# EAGLE design opl2msx_v1_1 (EAGLE 6.6.0)
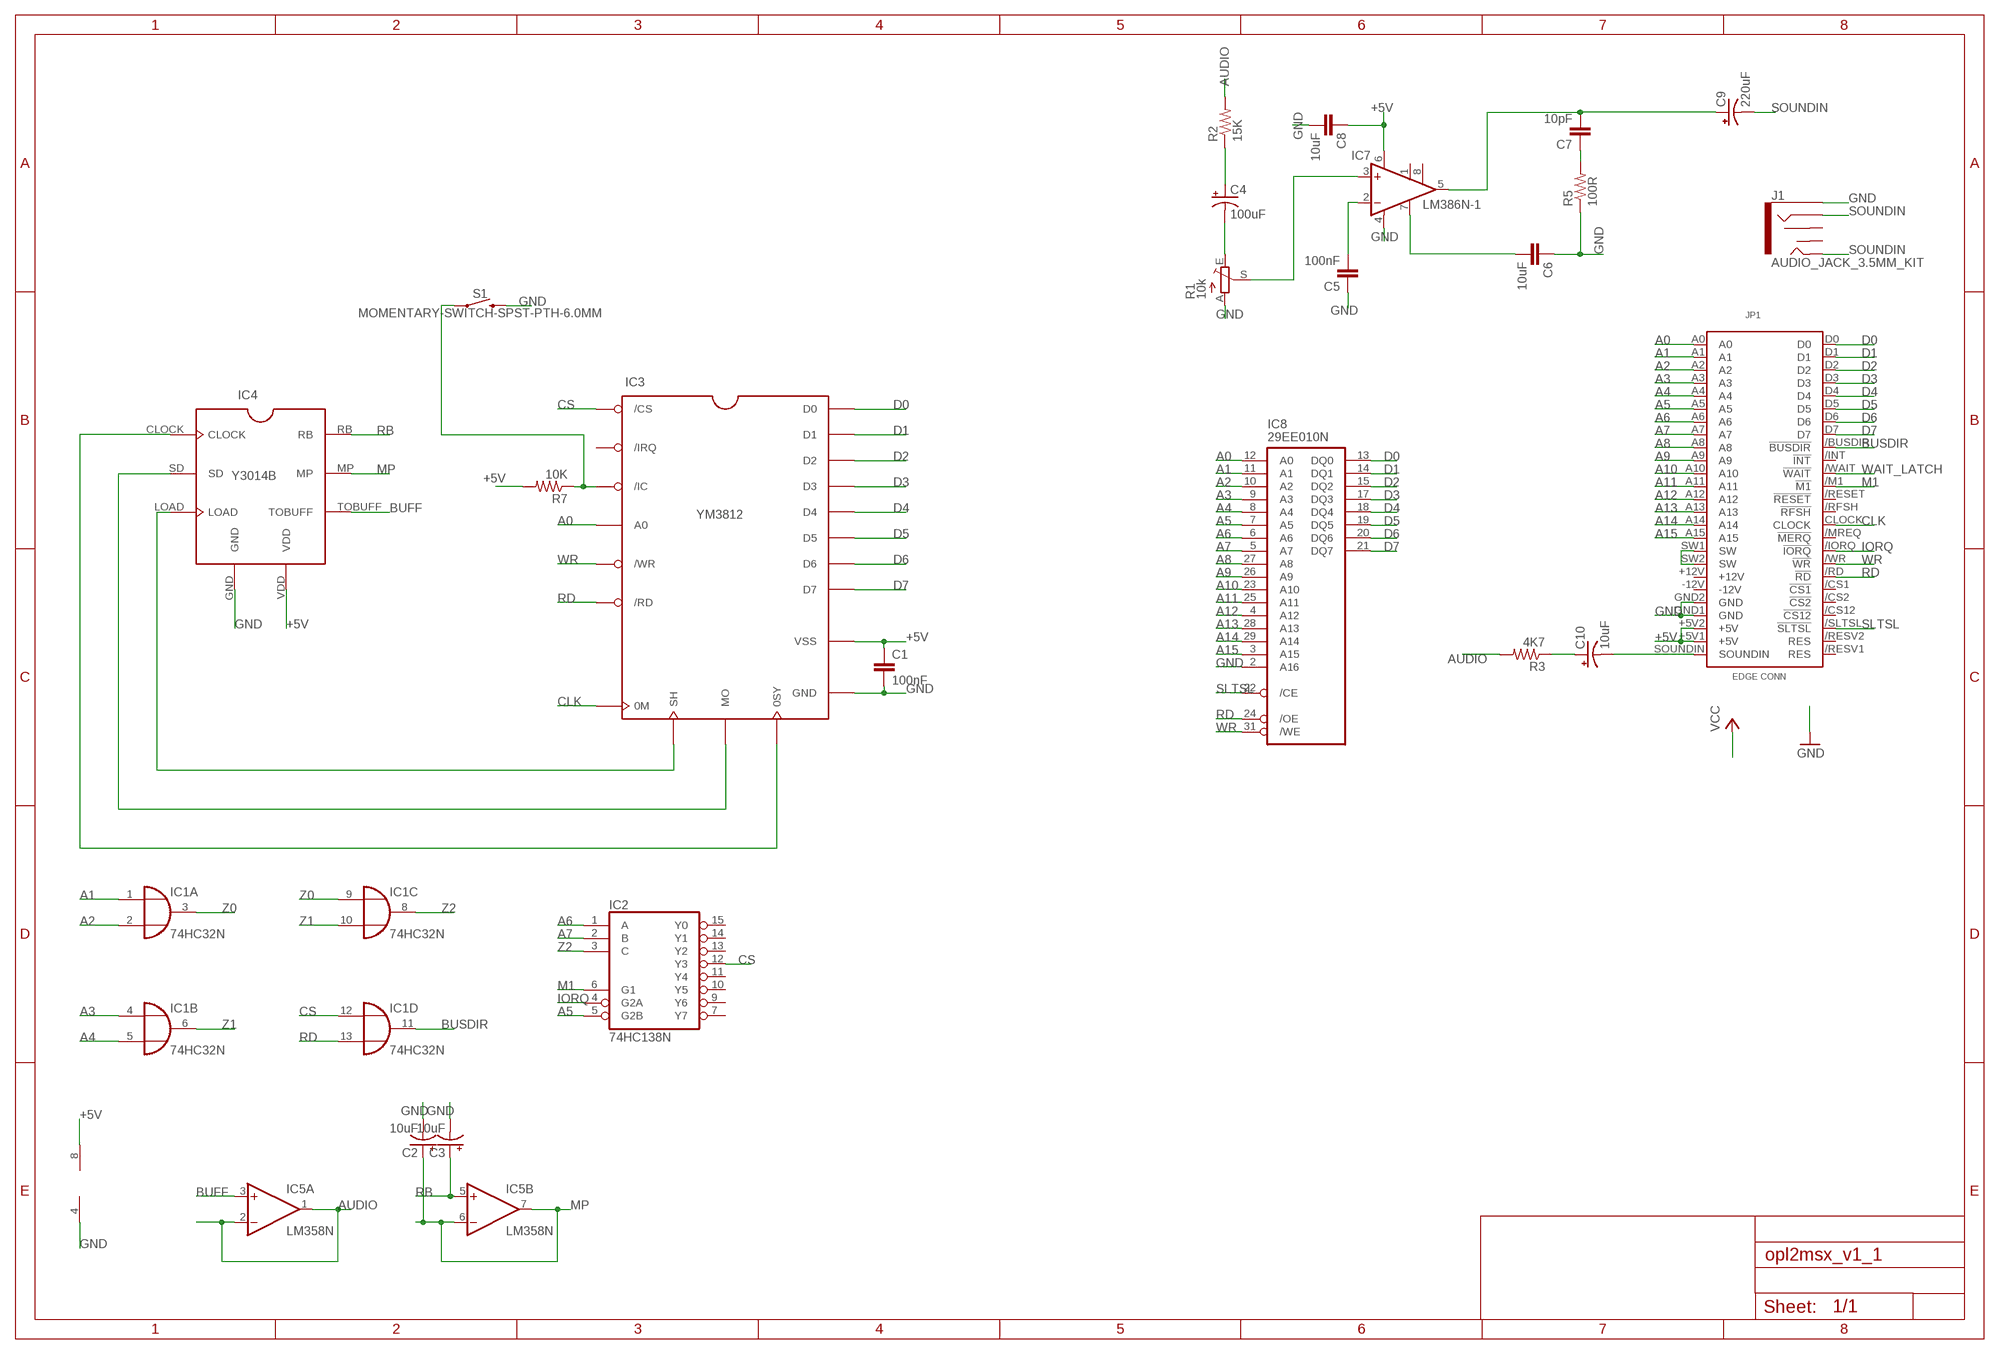
[diagram p0: schematic, sheet 1]

## Parts
C1  100nF  C-EU050-024X044  [C050-024X044]
C2  10uF  CPOL-USE2.5-6  [E2,5-6]
C3  10uF  CPOL-USE2.5-6  [E2,5-6]
C4  100uF  CPOL-USE2.5-6  [E2,5-6]
C5  100nF  C-EU050-024X044  [C050-024X044]
C6  10uF  C-EU050-024X044  [C050-024X044]
C7  10pF  C-EU050-024X044  [C050-024X044]
C8  10uF  C-EU050-024X044  [C050-024X044]
C9  220uF  CPOL-USE2.5-6  [E2,5-6]
C10  10uF  CPOL-USE2.5-6  [E2,5-6]
IC1  74HC32N  [DIL14]
IC2  74HC138N  [DIL16]
IC3  YM3812  YM3812-DIP24  [YM3812]
IC4  Y3014B  YM3014B-DIP8  [YM3014B]
IC5  LM358N  [DIL08]
IC7  LM386N-1  [DIL08]
IC8  29EE010N  29XE010N  [DIL32-6]
J1  AUDIO_JACK_3.5MM_KIT  [AUDIO-JACK-KIT]
JP1  MSXCART  [PATOLA-MSX-SEEED]
R1  10k  TRIM_EU-CA6V  [CA6V]
R2  15K  R-US_0207/10  [0207/10]
R3  4K7  R-US_0207/10  [0207/10]
R5  100R  R-US_0207/10  [0207/10]
R7  10K  R-US_0207/10  [0207/10]
S1  MOMENTARY-SWITCH-SPST-PTH-6.0MM  [TACTILE_SWITCH_PTH_6.0MM]

## Nets
+5V: C1.1 C8.1 IC3.VSS IC4.VDD IC5.8(P:V+) IC7.6(VS) JP1.+5V1(+5V) JP1.+5V2(+5V) R7.2 ; supply symbol labelled VCC
A0: IC3.A0 IC8.12(A0) JP1.A0
A1: IC1.1(A:I0) IC8.11(A1) JP1.A1
A2: IC1.2(A:I1) IC8.10(A2) JP1.A2
A3: IC1.4(B:I0) IC8.9(A3) JP1.A3
A4: IC1.5(B:I1) IC8.8(A4) JP1.A4
A5: IC2.5(G2B) IC8.7(A5) JP1.A5
A6: IC2.1(A) IC8.6(A6) JP1.A6
A7: IC2.2(B) IC8.5(A7) JP1.A7
A8: IC8.27(A8) JP1.A8
A9: IC8.26(A9) JP1.A9
A10: IC8.23(A10) JP1.A10
A11: IC8.25(A11) JP1.A11
A12: IC8.4(A12) JP1.A12
A13: IC8.28(A13) JP1.A13
A14: IC8.29(A14) JP1.A14
A15: IC8.3(A15) JP1.A15
AUDIO: IC5.1(A:OUT) IC5.2(A:-IN) R2.2 R3.2
BUFF: IC4.TOBUFF IC5.3(A:+IN)
BUSDIR: IC1.11(D:O) JP1./BUSDIR(!BUSDIR)
CLK: IC3.0M JP1.CLOCK
CS: IC1.12(D:I0) IC2.12(Y3) IC3./CS
D0: IC3.D0 IC8.13(DQ0) JP1.D0
D1: IC3.D1 IC8.14(DQ1) JP1.D1
D2: IC3.D2 IC8.15(DQ2) JP1.D2
D3: IC3.D3 IC8.17(DQ3) JP1.D3
D4: IC3.D4 IC8.18(DQ4) JP1.D4
D5: IC3.D5 IC8.19(DQ5) JP1.D5
D6: IC3.D6 IC8.20(DQ6) JP1.D6
D7: IC3.D7 IC8.21(DQ7) JP1.D7
GND: C1.2 C2.- C3.- C5.1 C6.1 C8.2 IC3.GND IC4.GND IC5.4(P:V-) IC7.4(GND) IC8.2(A16) J1.SLEEVE JP1.GND1(GND) JP1.GND2(GND) R1.A R5.1 S1.3
IORQ: IC2.4(G2A) JP1./IORQ(!IORQ)
M1: IC2.6(G1) JP1./M1(!M1)
MP: C2.+ IC4.MP IC5.6(B:-IN) IC5.7(B:OUT)
N$1: C4.+ R2.1
N$2: C6.2 IC7.7(BYPASS)
N$3: C4.- R1.E
N$4: IC7.3(+IN) R1.S
N$5: C5.2 IC7.2(-IN)
N$6: C10.- JP1.SOUNDIN
N$7: C10.+ R3.1
N$9: C7.2 C9.+ IC7.5(OUT)
N$12: C7.1 R5.2
N$13: IC3.SH IC4.LOAD
N$14: IC3.MO IC4.SD
N$15: IC3.0SY IC4.CLOCK
N$16: IC3./IC R7.1 S1.1
N$30: JP1.SW1(SW) JP1.SW2(SW)
RB: C3.+ IC4.RB IC5.5(B:+IN)
RD: IC1.13(D:I1) IC3./RD IC8.24(/OE) JP1./RD(!RD)
SLTSL: IC8.22(/CE) JP1./SLTSL(!SLTSL)
SOUNDIN: C9.- J1.RING J1.TIP
WAIT_LATCH: JP1./WAIT(!WAIT)
WR: IC3./WR IC8.31(/WE) JP1./WR(!WR)
Z0: IC1.3(A:O) IC1.9(C:I0)
Z1: IC1.6(B:O) IC1.10(C:I1)
Z2: IC1.8(C:O) IC2.3(C)
Unconnected: IC2.7(Y7) IC2.9(Y6) IC2.10(Y5) IC2.11(Y4) IC2.13(Y2) IC2.14(Y1) IC2.15(Y0) IC3./IRQ IC7.1(GAIN) IC7.8(GAIN) IC8.1(NC) IC8.30(NC) J1.RSH J1.TSH JP1.+12V JP1.-12V JP1./CS1(!CS1) JP1./CS2(!CS2) JP1./CS12(!CS12) JP1./INT(!INT) JP1./MREQ(!MERQ) JP1./RESET(!RESET) JP1./RESV1(RES) JP1./RESV2(RES) JP1./RFSH(!RFSH)

## Power pins joined to a net without a drawn wire
+5V: IC1.14(P:VCC) IC2.16(VCC) IC8.32(VCC)
GND: IC1.7(P:GND) IC2.8(GND) IC8.16(GND)

## Library data of the parts
C1 C5-C8 = rcl:C-EU: CAPACITOR, European symbol
C2-C4 C9 C10 = rcl:CPOL-US: POLARIZED CAPACITOR, American symbol
IC1 = 74xx-eu:74*32: Quad 2-input OR gate
IC2 = 74xx-eu:74*138: 3-line to 8-line DECODER/DEMULTIPLEXER
IC3 = YMSynth:YM3812: YM3812
IC4 = YMSynth:YM3014B: YM3014B
IC5 = linear:LM358: OP AMP also LM158; LM258; LM2904 Source: http://cache.national.com/ds/LM/LM158.pdf
IC7 = linear:LM386?-*: Low Voltage Audio Power Amplifier Source: http://cache.national.com/ds/LM/LM386.pdf
IC8 = memories:29XE010
J1 = SparkFun-Connectors:AUDIO_JACK_3.5MM: Audio Jack 3.5mm variants of PTH and SMT stereo audio jack with bypass switches. SparkFun Products: SparkFun SparkPunk Sound Kit <[https://www.sparkfun.com/products/11177]> - PTH MP3 Trigger <https://www.sparkfun.com/products/13720> -3.5mm SMD SparkFun PicoBoard <https://www.sparkfun.com/products/11888>- 2.5mm SMD; PROD_ID: CONN-08774; SF_ID: PRT-08032
JP1 = msx-con-seeed:MSXCART
R1 = pot:TRIM_EU-: POTENTIOMETER
R2 R3 R5 R7 = resistor:R-US_: RESISTOR, American symbol
S1 = SparkFun-Switches:MOMENTARY-SWITCH-SPST: Momentary Switch (Pushbutton) - SPST Normally-open (NO) SPST momentary switches (buttons, pushbuttons). Variants PTH-12MM - 12mm square, through-hole Momentary Pushbutton Switch - 12mm Square <https://www.sparkfun.com/products/9190> (COM-09190) PTH-6.0MM, PTH-6.0MM-KIT - 6.0mm square, through-hole Mini Pushbutton Switch <https://www.sparkfun.com/products/97> (COM-00097) KIT package intended for soldering kit's - only one side of pads' copper is exposed. PTH-RIGHT-ANGLE-KIT - Right-angle, through-hole Right Angle Tactile Button <https://www.sparkfun.com/products/10791> - Used on SparkFun BigTime Watch Kit <https://www.sparkfun.com/products/11734> SMD-12MM - 12mm square, surface-mount Tactile Button - SMD (12mm) <https://www.sparkfun.com/products/12993> (COM-12993) Used on SparkFun PicoBoard <https://www.sparkfun.com/products/11888> SMD-4.5MM - 4.5mm Square Trackball Switch Used on SparkFun Blackberry Trackballer Breakout <https://www.sparkfun.com/products/13169> SMD-4.6MMX2.8MM - 4.60mm x 2.80mm, surface mount Used on SparkFun SAMD21 Mini Breakout <https://www.sparkfun.com/products/13664> SMD-5.2MM, SMD-5.2-REDUNDANT - 5.2mm square, surface-mount Mini Pushbutton Switch - SMD <https://www.sparkfun.com/products/8720> (COM-08720) Used on Arduino Pro Mini <https://www.sparkfun.com/products/11114> REDUNDANT package connects both switch circuits together SMD-6.0X3.5MM - 6.0 x 3.5mm, surface mount Momentary Reset Switch SMD <https://www.sparkfun.com/products/8229> (COM-08229) SMD-6.2MM-TALL - 6.2mm square, surface mount Tactile Button - SMD (6mm) <https://www.sparkfun.com/products/12992> Used on SparkFun Digital Sandbox <https://www.sparkfun.com/products/12651> SMD-RIGHT-ANGLE - Right-angle, surface mount Used on SparkFun Block for Intel® Edison - Arduino <https://www.sparkfun.com/products/13036>; PROD_ID: SWCH-08441; SF_SKU: COM-00097

## Board
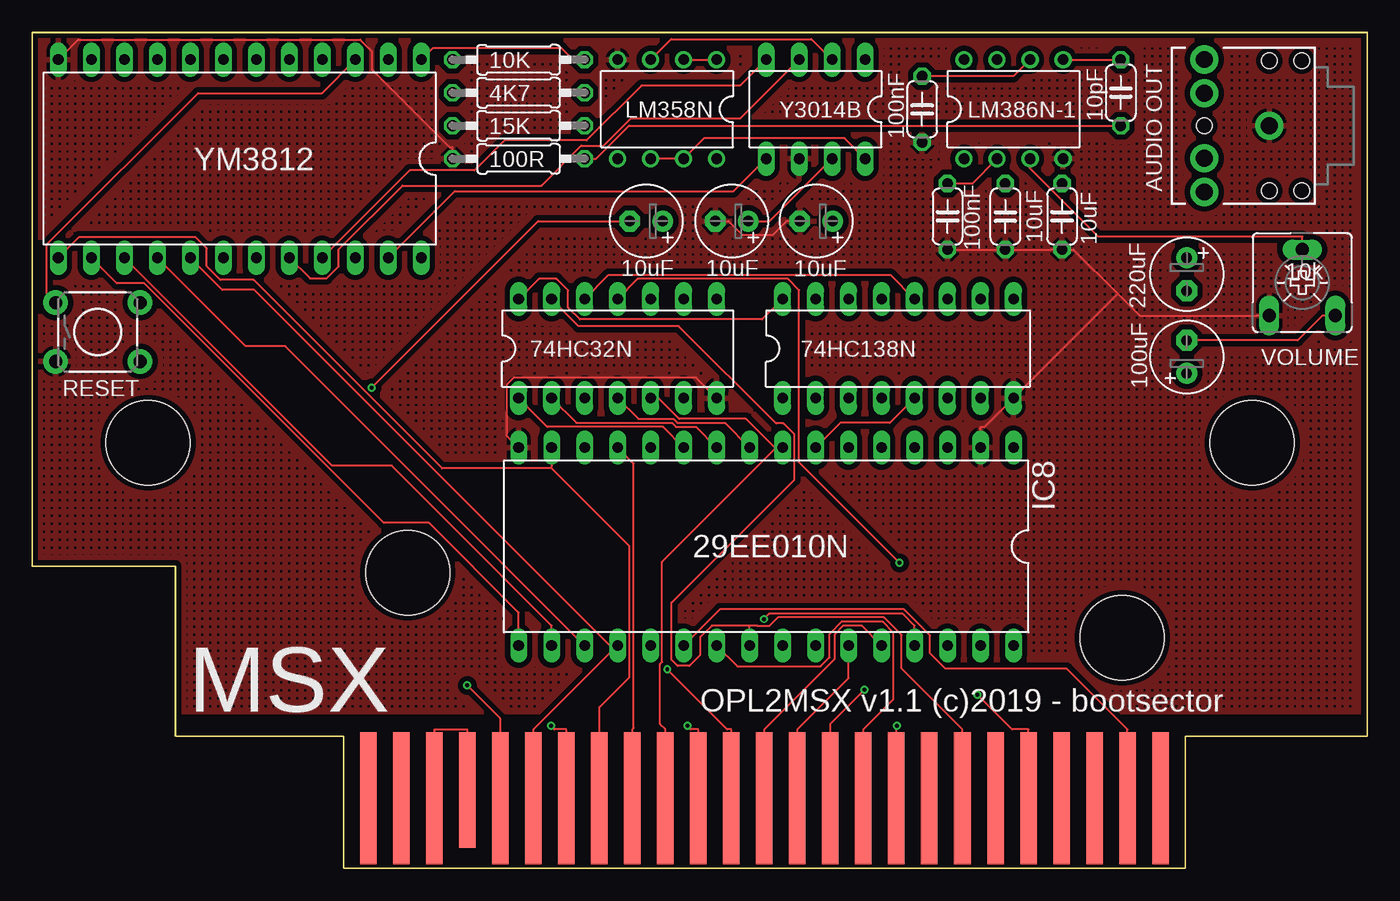
[diagram p1: board, top side]
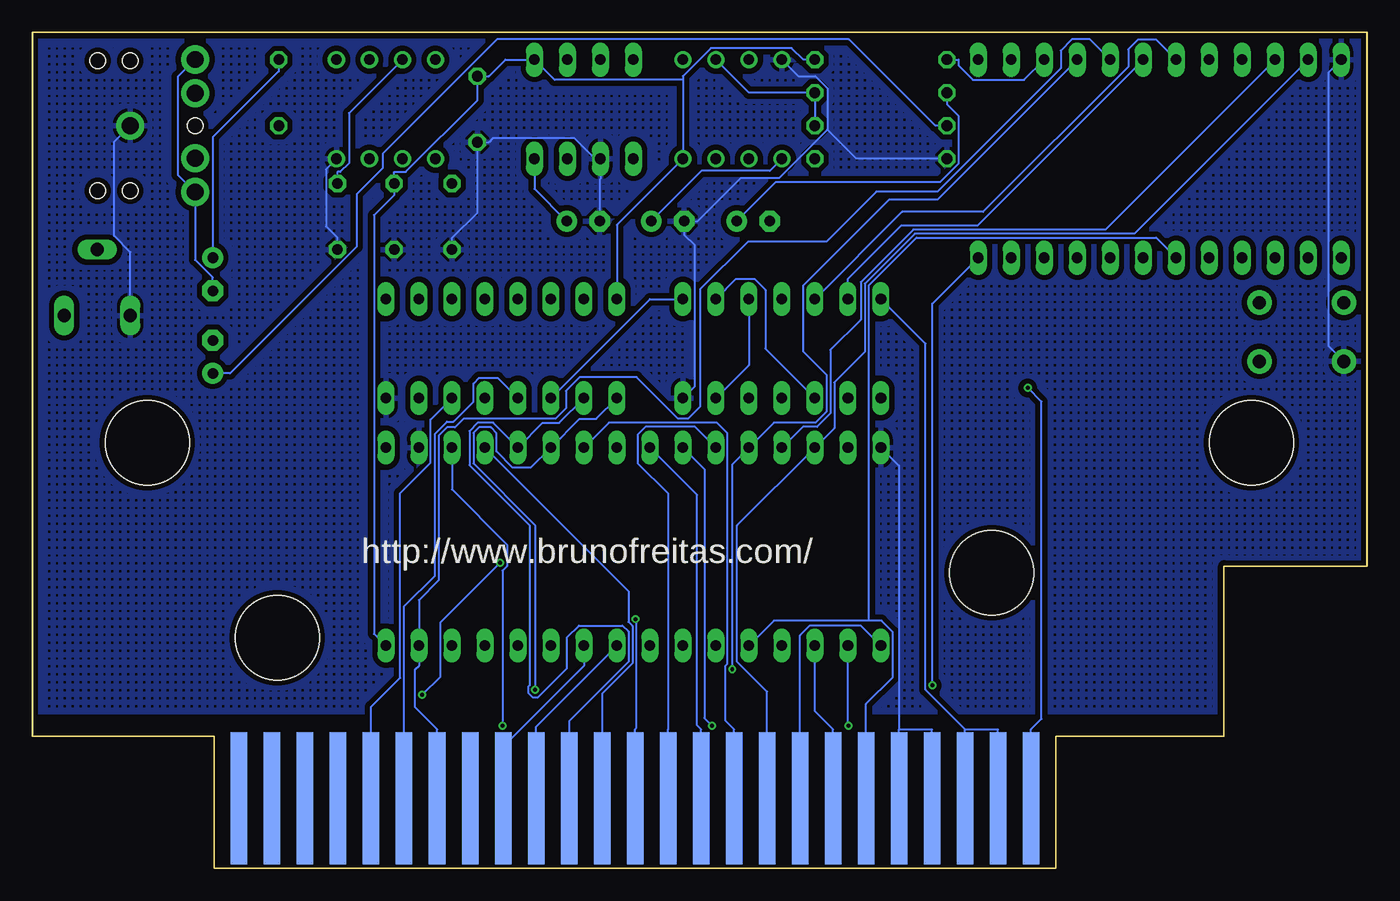
[diagram p2: board, bottom side, seen from below]

Size 102.72 x 64.33 mm. Coordinates in mm from the lower left corner, seen from the top.
Outline: 0,64.31 102.72,64.31 102.72,10.16 88.72,10.16 88.72,0 23.95,0 23.95,10.16 11,10.16 11,23.27 0,23.27 0,64.31
Copper layers (1*16): Top 0.035mm / dielectric 1.5mm / Bottom 0.035mm
Design rules "SeeedStudio_2layer_DRU_no_angle_20140221": minimum track width 6mil, minimum drill 12mil, track to track 6mil, track to pad 6mil, pad to pad 6mil, via to via 6mil, smd to smd 0mil, copper to edge 10mil, drill to drill 10mil, minimum pad ring 10mil, minimum via ring 6mil, stop-mask expansion 2mil, vias tented up to drill 100mil, thermal gap 10mil

### Footprints (pad centres in the part's own frame; a part is rotated, then mirrored left to right if it is on the bottom)
C050-024X044 = drill 0.813 octagon: 1 -2.54,0; 2 2.54,0
E2,5-6 = drill 0.813 pad 1.6: + -1.27,0 | drill 0.813 pad 1.6 octagon: - 1.27,0
DIL14 = drill 0.813 long: 1 -7.62,-3.81; 2 -5.08,-3.81; 3 -2.54,-3.81; 4 0,-3.81; 5 2.54,-3.81; 6 5.08,-3.81; 7 7.62,-3.81; 8 7.62,3.81; 9 5.08,3.81; 10 2.54,3.81; 11 0,3.81; 12 -2.54,3.81; 13 -5.08,3.81; 14 -7.62,3.81
DIL16 = drill 0.813 long: 1 -8.89,-3.81; 2 -6.35,-3.81; 3 -3.81,-3.81; 4 -1.27,-3.81; 5 1.27,-3.81; 6 3.81,-3.81; 7 6.35,-3.81; 8 8.89,-3.81; 9 8.89,3.81; 10 6.35,3.81; 11 3.81,3.81; 12 1.27,3.81; 13 -1.27,3.81; 14 -3.81,3.81; 15 -6.35,3.81; 16 -8.89,3.81
YM3812 = drill 0.813 long: 0M -13.97,7.62; 0SY -11.43,7.62; /CS 1.27,-7.62; /IC -8.89,-7.62; /IRQ -11.43,-7.62; /RD -1.27,-7.62; /WR -3.81,-7.62; A0 -6.35,-7.62; D0 8.89,-7.62; D1 11.43,-7.62; D2 13.97,7.62; D3 11.43,7.62; D4 8.89,7.62; D5 6.35,7.62; D6 3.81,7.62; D7 1.27,7.62; GND 13.97,-7.62; MO -6.35,7.62; NC8 3.81,-7.62; NC9 6.35,-7.62; NC19 -1.27,7.62; NC22 -8.89,7.62; SH -3.81,7.62; VSS -13.97,-7.62
YM3014B = drill 0.813 long: CLOCK 3.81,3.81; GND 1.27,3.81; LOAD 1.27,-3.81; MP -3.81,3.81; RB -1.27,3.81; SD 3.81,-3.81; TOBUFF -1.27,-3.81; VDD -3.81,-3.81
DIL08 = drill 0.813 pad 1.27: 1 -3.81,-3.81; 2 -1.27,-3.81; 3 1.27,-3.81; 4 3.81,-3.81; 5 3.81,3.81; 6 1.27,3.81; 7 -1.27,3.81; 8 -3.81,3.81
DIL32-6 = drill 0.813 long: 1 -19.05,-7.62; 2 -16.51,-7.62; 3 -13.97,-7.62; 4 -11.43,-7.62; 5 -8.89,-7.62; 6 -6.35,-7.62; 7 -3.81,-7.62; 8 -1.27,-7.62; 9 1.27,-7.62; 10 3.81,-7.62; 11 6.35,-7.62; 12 8.89,-7.62; 13 11.43,-7.62; 14 13.97,-7.62; 15 16.51,-7.62; 16 19.05,-7.62; 17 19.05,7.62; 18 16.51,7.62; 19 13.97,7.62; 20 11.43,7.62; 21 8.89,7.62; 22 6.35,7.62; 23 3.81,7.62; 24 1.27,7.62; 25 -1.27,7.62; 26 -3.81,7.62; 27 -6.35,7.62; 28 -8.89,7.62; 29 -11.43,7.62; 30 -13.97,7.62; 31 -16.51,7.62; 32 -19.05,7.62
AUDIO-JACK-KIT = drill 1.3 pad 2.184: RING 5,5.1; RSH 5,2.5; SLEEVE 0,0; TIP 5,-5.1; TSH 5,-2.5 | hole 1.2: 0,5; -2.5,5; -2.5,-5; 0,-5; 5,0
PATOLA-MSX-SEEED = smd 1.27 x 10.16 bottom: +5V1 -24.13,-35.242; +5V2 -21.59,-35.242; /CS1 34.29,-35.242; /CS12 31.75,-35.242; /IORQ 21.59,-35.242; /M1 24.13,-35.242; /RESET 16.51,-35.242; /RESV2 29.21,-35.242; /WAIT 26.67,-35.242; /WR 19.05,-35.242; A1 1.27,-35.242; A3 -1.27,-35.242; A5 -3.81,-35.242; A7 8.89,-35.242; A9 13.97,-35.242; A11 11.43,-35.242; A12 6.35,-35.242; A14 3.81,-35.242; D1 -6.35,-35.242; D3 -8.89,-35.242; D5 -11.43,-35.242; D7 -13.97,-35.242; GND1 -19.05,-35.242; GND2 -16.51,-35.242; SOUNDIN -26.67,-35.242 | smd 1.27 x 10.16: +12V -24.13,-35.242; -12V -26.67,-35.242; /BUSDIR 24.13,-35.242; /CS2 34.29,-35.242; /INT 26.67,-35.242; /MREQ 21.59,-35.242; /RD 19.05,-35.242; /RESV1 16.51,-35.242; /RFSH 29.21,-35.242; /SLTSL 31.75,-35.242; A0 1.27,-35.242; A2 -1.27,-35.242; A4 -3.81,-35.242; A6 8.89,-35.242; A8 6.35,-35.242; A10 11.43,-35.242; A13 3.81,-35.242; A15 13.97,-35.242; CLOCK -16.51,-35.242; D0 -6.35,-35.242; D2 -8.89,-35.242; D4 -11.43,-35.242; D6 -13.97,-35.242; SW2 -21.59,-35.242 | smd 1.27 x 8.89: SW1 -19.05,-34.608 | hole 6.5: 41.35,-7.89; -43.64,-7.89; -23.64,-17.89; 31.35,-22.89
CA6V = drill 1.016 long: A -2.54,-2.54; E 2.54,-2.54; S 0,2.54
0207/10 = drill 0.813 octagon: 1 -5.08,0; 2 5.08,0
TACTILE_SWITCH_PTH_6.0MM = drill 1.016 pad 1.88: 1 -3.251,2.261; 2 3.251,2.261; 3 -3.251,-2.261; 4 3.251,-2.261

### Placement (x,y rotation side)
C1  68.48,58.42 270 top
C2  60.33,49.81 180 top
C3  53.83,49.81 180 top
C4  88.85,39.37 90 top
C5  70.44,50.16 90 top
C6  79.25,50.16 90 top
C7  83.77,59.69 90 top
C8  74.88,50.16 270 top
C9  88.85,45.72 270 top
C10  47.25,49.81 180 top
IC1  45.04,40.01 0 top
IC2  66.63,40.01 0 top
IC3  15.95,54.61 180 top
IC4  60.28,58.42 180 top
IC5  48.85,58.42 180 top
IC7  75.52,58.42 0 top
IC8  56.47,24.77 180 top
J1  95.2,57.15 180 top
JP1  52.53,40.64 0 top
R1  97.74,45.09 0 top
R2  37.42,57.15 0 top
R3  37.42,59.69 0 top
R5  37.42,54.61 0 top
R7  37.42,62.23 0 top
S1  5.03,41.27 0 top

### Tracks (layer width: path | path; a pad name or v marks a point on that pad's centre or on a via)
+5V
  Top 0.152: IC2.16 56.17,42.25 42.14,42.25 41.23,43.16 41.23,44.47 40.33,45.38 38.98,45.38 IC1.14 | IC7.6 75.52,60.96 C1.1 | R7.2 41.61,62.23 40.71,63.12 30.82,63.12 IC3.VSS
  Bottom 0.152: 30.94,10.71 33.99,13.75 33.99,40.39 IC1.14 | 52.66,60.67 IC5.8 57.74,49.53 IC2.16 | 52.66,60.67 52.66,60.97 50.5,63.13 44.29,63.13 43.39,62.23 R7.2 | 52.66,60.67 62.53,60.67 IC4.VDD 66.32,62.23 67.59,60.96 C1.1 68.48,59.11 73.99,53.59 74.88,53.59 C8.1 74.88,51.82 76.43,50.27 76.43,18.06 IC8.32 | JP1.+5V2 30.94,10.71 | 30.94,10.71 28.4,10.71 JP1.+5V1
A0  (via drill 0.3 pad 0.61)
  Top 0.152: JP1.A0 53.8,10.71 53.47,10.71 v48.86,15.32
  Bottom 0.152: IC3.A0 33.07,51.47 36.79,51.47 43.41,44.85 43.41,39.79 41.61,37.99 41.61,35.15 42.45,34.3 45.66,34.3 IC8.12 48.86,31.1 v48.86,15.32
A1
  Top 0.152: IC8.11 48.52,33.98 39.63,33.98 IC1.1
  Bottom 0.152: JP1.A1 53.8,10.71 53.8,28.85 56.14,31.19 56.14,33.39 55.52,34 51.73,34 IC8.11
A2  (via drill 0.3 pad 0.61)
  Top 0.152: JP1.A2 51.26,10.71 50.69,10.71 v50.42,10.98 | IC1.2 41.86,34.29 49.22,34.29 49.52,33.98 51.06,33.98 IC8.10
  Bottom 0.152: IC8.10 51.01,30.73 51.01,11.57 v50.42,10.98
A3
  Top 0.152: IC1.4 46.64,34.59 49.34,34.59 49.65,34.29 53.29,34.29 IC8.9
  Bottom 0.152: JP1.A3 51.26,10.71 51.56,11.01 51.56,28.75 IC8.9
A4
  Top 0.152: 57.18,32.32 57.23,32.36 57.71,32.36 IC8.8 | 57.18,32.32 48.47,23.6 48.47,15.89 48.32,15.74 48.32,11.11 48.72,10.71 JP1.A4 | 57.18,32.32 54.91,34.59 49.77,34.59 48.17,36.2 IC1.5
A5
  Top 0.152: IC2.5 65.99,34.29 62.18,34.29 IC8.7
  Bottom 0.152: JP1.A5 48.72,10.71 49.39,11.38 49.39,15.59 49.23,15.76 49.23,33.48 50.05,34.3 58.36,34.3 IC8.7
A6  (via drill 0.3 pad 0.61)
  Top 0.152: JP1.A6 61.42,11.12 v64.04,13.74
  Bottom 0.152: v64.04,13.74 64.04,26.42 68.79,31.17 68.79,33.51 68.36,33.94 67.44,33.94 67.01,33.5 67.01,32.09 65.75,30.84 64.37,30.84 IC8.6 60.61,34.59 59.34,34.59 IC2.1
A7
  Bottom 0.152: JP1.A7 61.42,11.33 56.85,15.9 56.85,18.23 57.31,18.7 60.67,18.7 61.58,17.78 61.58,15.41 63.81,13.19 64.25,13.19 64.58,13.52 64.58,13.96 64.44,14.1 64.44,26.39 69.1,31.05 69.1,33.65 68.45,34.3 67.27,34.3 IC8.5 63.46,34.28 62.19,34.28 IC2.2
A8
  Top 0.152: JP1.A8 58.88,10.71 62.82,14.64 IC8.27
A9
  Bottom 0.152: IC8.26 60.28,15.6 66.5,9.37 JP1.A9
A10
  Top 0.152: IC8.23 54.25,15.55 60.67,15.55 61.35,16.23 61.35,18.04 62.32,19.01 65.41,19.01 66.25,18.17 66.25,12.99 63.96,10.71 JP1.A10
A11
  Bottom 0.152: JP1.A11 63.96,10.92 IC8.25
A12
  Bottom 0.152: IC8.4 56.85,21.34 56.85,18.97 56.54,18.67 56.54,15.77 58.88,13.44 JP1.A12
A13
  Top 0.152: IC8.28 63.8,18.7 62.44,18.7 61.76,18.02 61.76,16.13 56.34,10.71 JP1.A13
A14  (via drill 0.3 pad 0.61)
  Top 0.152: v56.31,19.19 56.74,19.62 66.97,19.62 67.9,18.7 IC8.29
  Bottom 0.152: v56.31,19.19 56.24,19.12 56.24,10.81 56.34,10.71 JP1.A14
A15  (via drill 0.3 pad 0.61)
  Top 0.152: JP1.A15 66.5,10.71 66.55,10.76 v66.55,10.98
  Bottom 0.152: IC8.3 70.44,29.16 66.2,24.92 66.2,23.27 66.55,22.91 v66.55,10.98
AUDIO
  Top 0.152: IC5.2 IC5.1
  Bottom 0.152: IC5.2 47.58,59.69 R3.2 R2.2
BUFF
  Top 0.152: IC5.3 49.16,63.82 59.96,63.82 IC4.TOBUFF
BUSDIR  (via drill 0.3 pad 0.61)
  Top 0.152: v66.74,23.52 59.01,31.25 59.01,44.5 58.14,45.36 46.59,45.36 IC1.11 | JP1./BUSDIR 76.66,10.71 75.39,10.71 v72.73,13.37
  Bottom 0.152: v72.73,13.37 71.33,14.77 71.33,18.93 v66.74,23.52
CLK  (via drill 0.3 pad 0.61)
  Top 0.152: JP1.CLOCK 36.02,11.53 v33.45,14.1
  Bottom 0.152: v33.45,14.1 33.45,43.46 IC3.0M
CS
  Top 0.152: IC1.12 44.36,45.67 66.04,45.67 IC2.12
  Bottom 0.152: IC3./CS 16.24,63.78 17.63,63.78 18.39,63.03 18.39,61.68 29.55,50.52 35.8,50.52 IC1.12
D0
  Top 0.152: JP1.D0 46.18,10.71 46.28,10.8 46.28,31.14 IC8.13
  Bottom 0.152: IC3.D0 20.14,49.15 34.93,49.15 38.96,45.12 38.96,42.24 41.3,39.9 41.3,35.02 42.34,33.98 43.44,33.98 | 43.44,33.98 | 43.44,33.98 IC8.13
D1
  Bottom 0.152: JP1.D1 46.18,13.6 48.48,15.9 48.48,26.4 IC8.14 41,33.88 41,37.41 38.66,39.76 38.66,45 34.81,48.84 17.91,48.84 IC3.D1
D2
  Top 0.152: JP1.D2 43.64,12.41 45.94,14.71 45.94,24.8 39.96,30.79 | 39.96,30.79 39.96,30.91 IC8.15 | 39.96,30.79 31.51,30.79 17.01,45.29 14.46,45.29 13.41,46.34 13.41,47.71 12.56,48.56 3.56,48.56 IC3.D2
D3
  Top 0.152: IC8.17 37.42,19.7 30.53,26.58 27.04,26.58 8.6,45.02 6.49,45.02 IC3.D3
  Bottom 0.152: JP1.D3 43.64,17.94 42.88,18.71 38.98,18.71 IC8.17
D4  (via drill 0.3 pad 0.61)
  Top 0.152: JP1.D4 41.1,10.71 40.17,10.71 v39.9,10.98 | IC3.D4 23.05,31 27.65,31 39.96,18.7 IC8.18
  Bottom 0.152: v39.9,10.98 39.96,11.04 IC8.18
D5
  Top 0.152: IC8.19 19.45,40.19 16.41,40.19 IC3.D5
  Bottom 0.152: JP1.D5 41.1,10.71 42.5,12.1 IC8.19
D6
  Top 0.152: 44.72,16.87 17.07,44.52 14.61,44.52 IC3.D6 | IC8.20 44.76,16.87 44.72,16.87 | 44.72,16.87 | 44.72,16.87 38.56,10.71 JP1.D6
D7
  Bottom 0.152: 38.35,19.06 38.35,44.87 34.68,48.54 16.23,48.54 IC3.D7 | JP1.D7 38.56,12.66 36.5,14.73 36.5,18.18 37.38,19.06 38.35,19.06 | 38.35,19.06 45.66,19.06 IC8.21
GND
  Top 0.152: C2.- 58.03,49.81 57,48.78 54.61,48.78 53.58,49.81 C3.- | 83.54,44.22 84.71,43.06 | 84.71,43.06 | 84.71,43.06 85.22,42.55 94.21,42.55 R1.A | 83.54,44.22 80.14,47.62 C6.1 78.36,47.62 C8.2 C5.1 | 83.54,44.22 IC2.8 73.26,33.93 72.98,33.93 IC8.2 | R5.1 32.34,55.5 32.11,55.5 26.11,61.5 26.11,62.89 25.22,63.78 3.54,63.78 IC3.GND | IC1.7 51.09,37.77 37.05,37.77 36.51,37.23 36.51,33.29 IC8.16
  Bottom 0.152: IC8.16 36.02,30.99 36.02,10.71 | 36.02,10.71 33.48,10.71 JP1.GND1 | S1.3 2.95,40.19 2.95,61.26 IC3.GND | 41.54,56.85 45.28,53.11 48.23,53.11 51.53,49.81 C3.- 52.55,48.78 51.73,47.96 51.73,37.12 IC1.7 | JP1.GND2 36.02,10.71 | 41.54,56.85 39.3,54.61 33.23,54.61 R5.1 | 59.01,54.19 60.99,56.17 67.3,56.17 67.59,55.88 C1.2 68.48,50.47 70.44,48.51 C5.1 | 59.01,54.19 59.01,53.06 59.06,53.01 C2.- | IC4.GND 59.01,54.19 | IC5.4 43.77,60.96 42.46,60.96 41.54,60.04 41.54,56.85 | C6.1 79.25,48.51 80.14,49.4 80.14,53.8 IC7.4 | R1.A 95.2,47.43 96.45,48.68 96.45,55.9 J1.SLEEVE
  pour Bottom (isolate 0.406, hatched): -0.05,64.14 102.82,64.14 102.82,12.06 -0.05,12.06
  pour Top (isolate 0.406, hatched): -0.05,64.14 102.82,64.14 102.82,12.06 -0.05,12.06
IORQ
  Bottom 0.152: IC2.4 66.91,37.75 68.34,37.75 68.79,37.31 68.79,35.9 70.32,34.37 70.81,34.37 71.75,33.44 71.75,22.53 74.12,20.16 74.12,10.71 JP1./IORQ
M1
  Bottom 0.152: JP1./M1 76.66,12.43 74.42,14.66 74.42,28.89 72.09,31.22 72.09,34.54 IC2.6
MP
  Top 0.152: IC5.6 IC5.7 51.7,56.19 62.51,56.19 IC4.MP
  Bottom 0.152: IC4.MP 64.09,52.3 C2.+
N$1
  Bottom 0.152: R2.1 33.23,57.15 39.88,63.8 66.97,63.8 75.77,55.01 75.77,53.89 77.77,51.89 77.77,47.85 87.51,38.1 C4.+
N$2
  Bottom 0.152: C6.2 79.25,53.59 79.03,53.59 78.36,54.26 78.36,58.12 IC7.7
N$3
  Top 0.152: R1.E 99.29,42.55 97.39,40.64 C4.-
N$4
  Top 0.152: R1.S 97.74,48.62 82.06,48.62 76.79,53.89 IC7.3
N$5
  Top 0.152: IC7.2 72.34,52.7 C5.2
N$6  (via drill 0.3 pad 0.61)
  Top 0.152: v26.11,36.98 38.93,49.81 C10.-
  Bottom 0.152: JP1.SOUNDIN 25.86,10.71 25.05,11.52 25.05,35.92 v26.11,36.98
N$7
  Bottom 0.152: R3.1 32.34,58.8 31.44,57.91 31.44,54.24 32.88,52.81 45.52,52.81 C10.+
N$9
  Top 0.152: IC7.5 C7.2
  Bottom 0.152: C7.2 83.77,61.34 88.85,56.26 C9.+
N$12
  Top 0.152: C7.1 45.93,57.15 43.39,54.61 R5.2
N$13
  Top 0.152: IC3.SH 21.35,45.4 22.64,45.4 23.57,46.33 23.57,47.64 28.48,52.55 39.18,52.55 42.24,55.61 43.96,55.61 46.08,57.73 54.51,57.73 IC4.LOAD
N$14
  Top 0.152: IC4.SD 54.48,60.24 46.87,60.24 42.66,56.03 36.32,56.03 34.02,53.72 29.03,53.72 IC3.MO
N$15
  Top 0.152: IC3.0SY 32.5,52.11 53.97,52.11 IC4.CLOCK
N$16
  Top 0.152: S1.1 1.09,44.22 1.09,48.02 12.74,59.67 22.28,59.67 IC3./IC
  Bottom 0.152: IC3./IC 26.39,60.68 30.34,60.68 31.45,61.78 31.45,62.23 R7.1
N$30
  Top 0.152: JP1.SW1 33.48,10.71 30.94,10.71 JP1.SW2
RB
  Top 0.152: C3.+ 56.75,49.81 IC4.RB
  Bottom 0.152: IC5.5 45.97,53.68 51.23,53.68 C3.+
RD
  Top 0.152: 55.2,18.7 52.29,18.7 51.39,17.79 51.39,16.41 50.57,15.6 49.66,15.6 49.18,16.07 49.18,20.45 58.65,29.92 58.65,33.4 57.81,34.24 57.23,34.24 49.74,41.73 42.05,41.73 IC1.13 | 55.2,18.7 55.78,18.7 55.82,18.65 56.7,18.65 57.37,19.32 65.54,19.32 66.89,17.96 66.89,15.4 71.58,10.71 JP1./RD | IC8.24 55.2,18.7
  Bottom 0.152: IC3./RD 30,49.45 35.87,49.45 39.96,45.36 IC1.13
SLTSL
  Top 0.152: JP1./SLTSL 84.28,10.71 79.6,15.38 70.26,15.38 69.09,16.56 69.09,17.93 67.09,19.93 52.91,19.93 IC8.22
SOUNDIN
  Bottom 0.152: J1.TIP 91.54,60.92 91.54,53.38 J1.RING 90.2,46.83 88.85,45.48 C9.-
WR
  Bottom 0.152: IC3./WR 21.32,63.79 22.72,63.79 23.57,62.93 23.57,61.58 33.08,52.08 37.77,52.08 41.61,48.24 47.64,48.24 51.33,44.55 51.33,35.53 52.25,34.61 53.03,34.61 56.22,37.8 60.6,37.8 61.66,36.75 61.66,35.41 62.45,34.62 69.53,34.62 70.21,33.94 70.82,33.94 71.45,33.31 71.45,22.18 72.98,20.65 IC8.31 72.98,16.37 72.98,15.6 73.26,15.31 73.26,12.39 71.58,10.71 JP1./WR
Z0
  Bottom 0.152: IC1.9 48.57,45.37 47.16,45.37 46.31,44.52 46.31,40.01 IC1.3
Z1
  Bottom 0.152: IC1.10 47.58,38.73 IC1.6
Z2
  Bottom 0.152: IC2.3 55.2,43.81 IC1.8

### Text on the board
tPlace: AUDIO OUT | VOLUME | RESET | MSX | OPL2MSX v1.1 (c)2019 - bootsector
bPlace: http://www.brunofreitas.com/